# Altium schematic sheet Sheet1.SchDoc
size A3
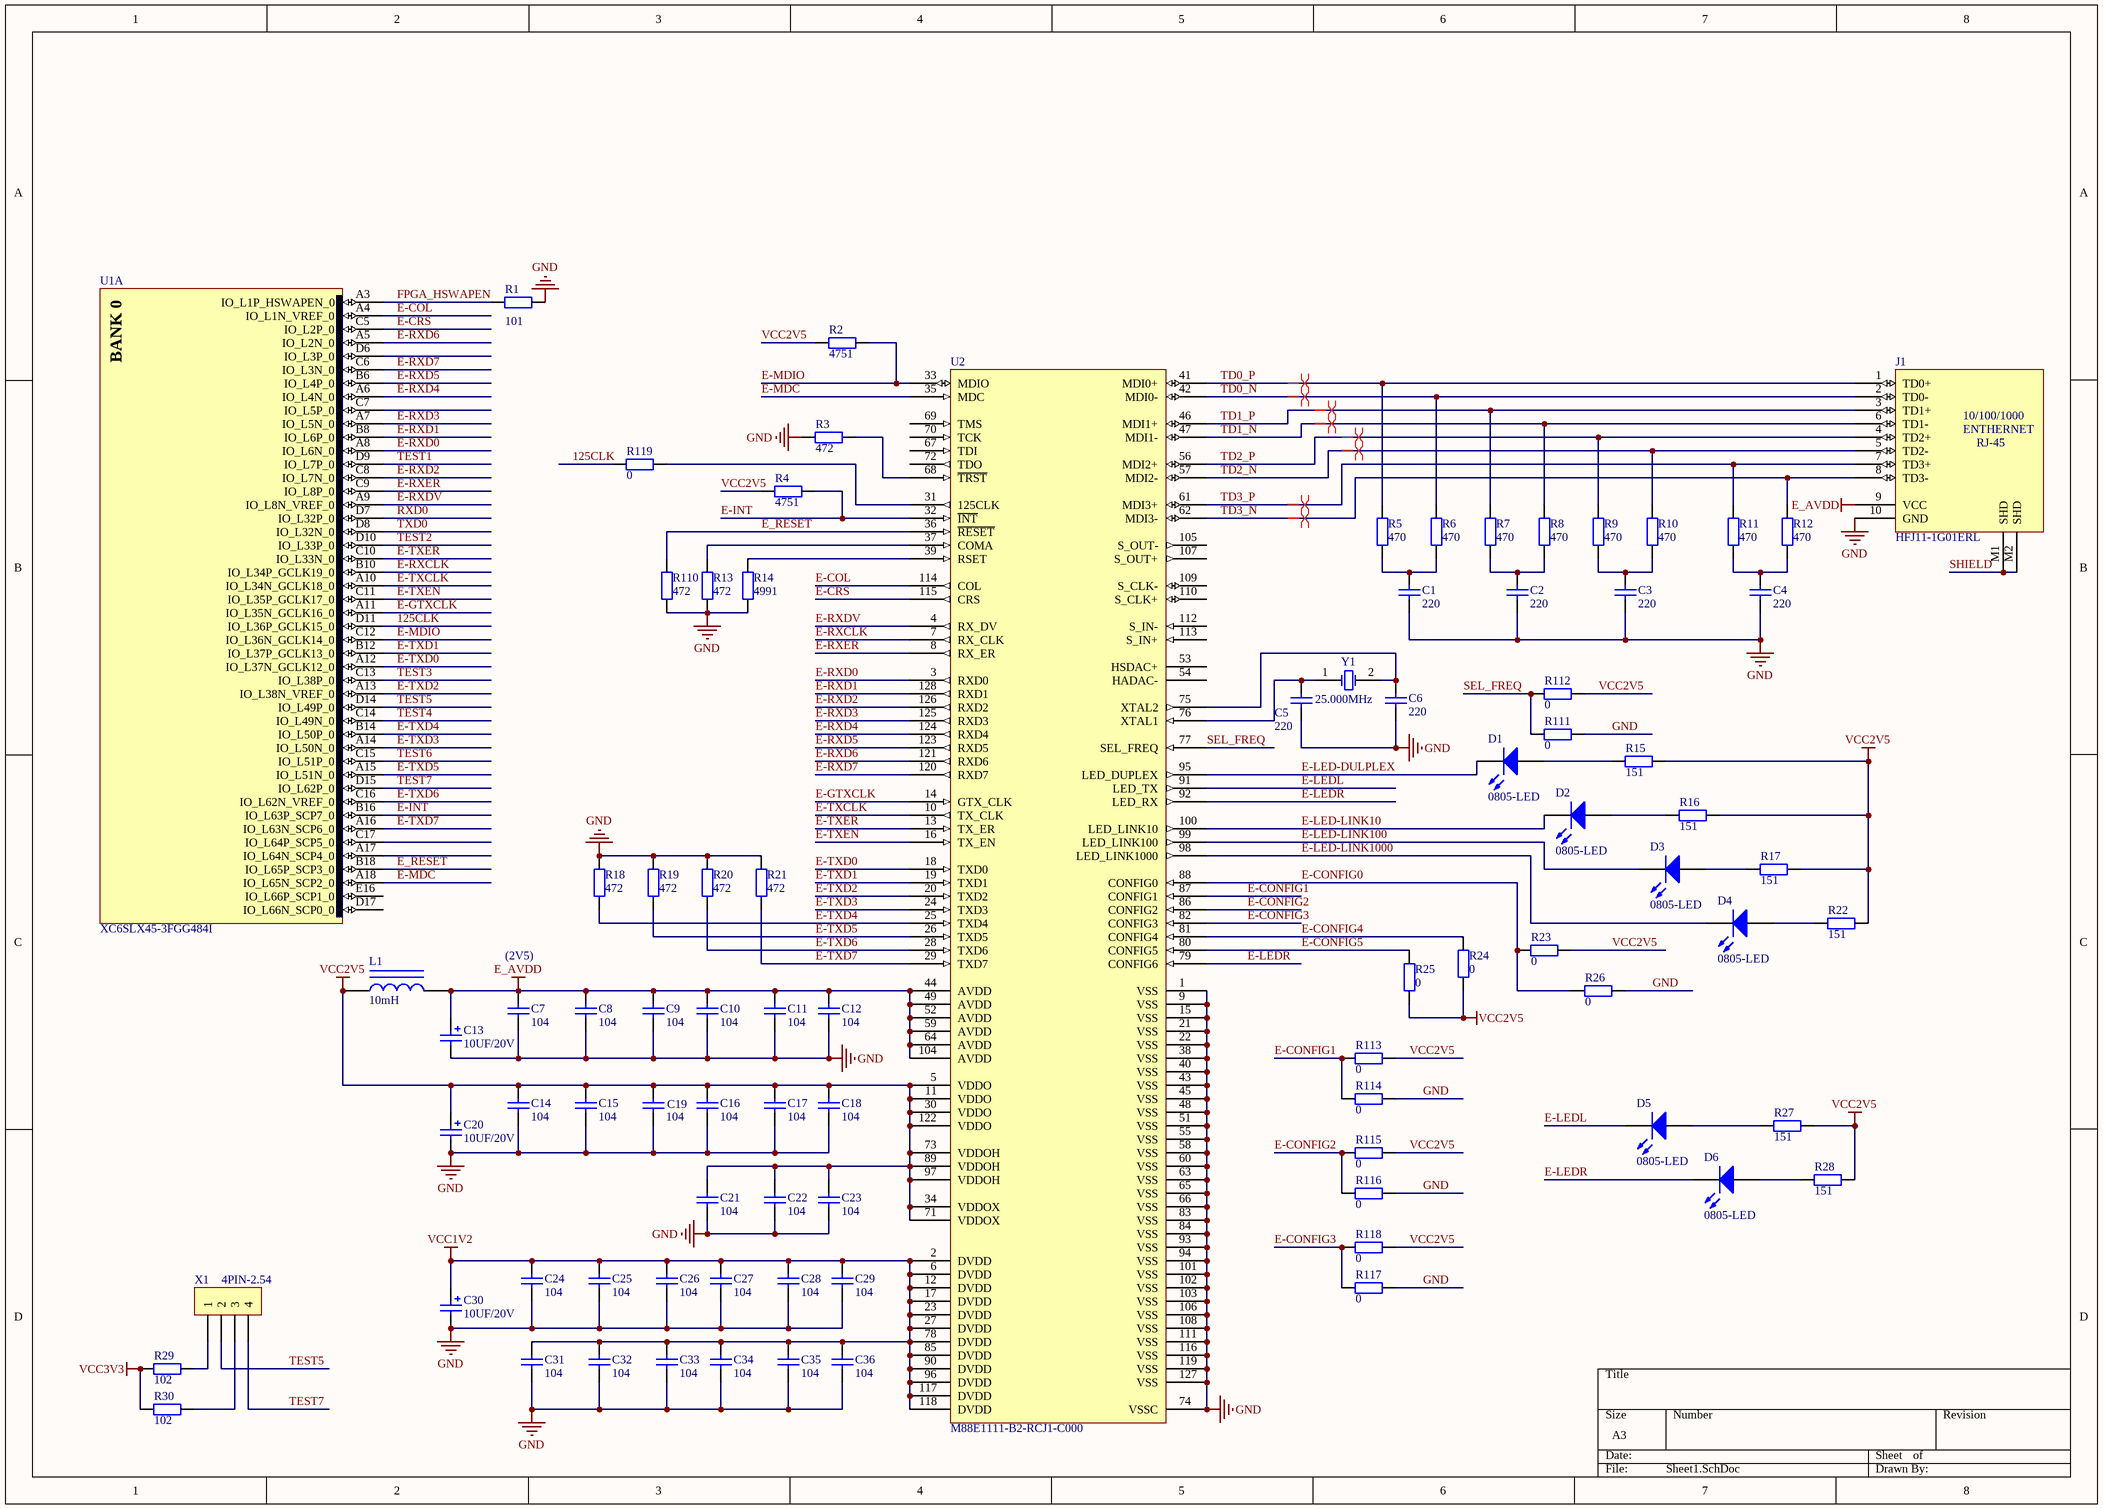
[diagram p0: Sheet1.SchDoc]

## Parts
C1  220  [0402]
C2  220  [0402]
C3  220  [0402]
C4  220  [0402]
C5  220  [0402]
C6  220  [0402]
C7  104  [0402]
C8  104  [0402]
C9  104  [0402]
C10  104  [0402]
C11  104  [0402]
C12  104  [0402]
C13  10UF/20V  [CAP-B]
C14  104  [0402]
C15  104  [0402]
C16  104  [0402]
C17  104  [0402]
C18  104  [0402]
C19  104  [0402]
C20  10UF/20V  [CAP-B]
C21  104  [0402]
C22  104  [0402]
C23  104  [0402]
C24  104  [0402]
C25  104  [0402]
C26  104  [0402]
C27  104  [0402]
C28  104  [0402]
C29  104  [0402]
C30  10UF/20V  [CAP-B]
C31  104  [0402]
C32  104  [0402]
C33  104  [0402]
C34  104  [0402]
C35  104  [0402]
C36  104  [0402]
D1  0805-LED  [0805LED]
D2  0805-LED  [0805LED]
D3  0805-LED  [0805LED]
D4  0805-LED  [0805LED]
D5  0805-LED  [0805LED]
D6  0805-LED  [0805LED]
J1  HFJ11-1G01ERL  [HFJ11-1G01ERL]
L1  10mH  [1206A]
R1  101  [0603]
R2  4751  [0603]
R3  472  [0603]
R4  4751  [0603]
R5  470  [0603]
R6  470  [0603]
R7  470  [0603]
R8  470  [0603]
R9  470  [0603]
R10  470  [0603]
R11  470  [0603]
R12  470  [0603]
R13  472  [0603]
R14  4991  [0603]
R15  151  [0603]
R16  151  [0603]
R17  151  [0603]
R18  472  [0603]
R19  472  [0603]
R20  472  [0603]
R21  472  [0603]
R22  151  [0603]
R23  0  [0603]
R24  0  [0603]
R25  0  [0603]
R26  0  [0603]
R27  151  [0603]
R28  151  [0603]
R29  102  [0603]
R30  102  [0603]
R110  472  [0603]
R111  0  [0402]
R112  0  [0402]
R113  0  [0402]
R114  0  [0402]
R115  0  [0402]
R116  0  [0402]
R117  0  [0402]
R118  0  [0402]
R119  0  [0603]
U1  XC6SLX45-3FGG484I  [FGG484]  (part A of 8)
U2  M88E1111-B2-RCJ1-C000  [SQFP50P1720X2320-128L]
X1  4PIN-2.54  [SIP4X]
Y1  25.000MHz  [CRYSTAL_2]

## Nets
E_AVDD: C7.2 C8.2 C9.2 C10.2 C11.2 C12.2 C13.1 J1.9(VCC) L1.2 U2.44(AVDD) U2.49(AVDD) U2.52(AVDD) U2.59(AVDD) U2.64(AVDD) U2.104(AVDD)
GND: C1.1 C2.1 C3.1 C4.1 C5.1 C6.1 C7.1 C8.1 C9.1 C10.1 C11.1 C12.1 C13.2 C14.1 C15.1 C16.1 C17.1 C18.1 C19.1 C20.2 C21.1 C22.1 C23.1 C24.1 C25.1 C26.1 C27.1 C28.1 C29.1 C30.2 C31.1 C32.1 C33.1 C34.1 C35.1 C36.1 J1.10(GND) R1.1 R3.1 R13.1 R14.1 R18.2 R19.2 R20.2 R21.2 R26.1 R110.1 R111.1 R114.1 R116.1 R117.1 U2.1(VSS) U2.9(VSS) U2.15(VSS) U2.21(VSS) U2.22(VSS) U2.38(VSS) U2.40(VSS) U2.43(VSS) U2.45(VSS) U2.48(VSS) U2.51(VSS) U2.55(VSS) U2.58(VSS) U2.60(VSS) U2.63(VSS) U2.65(VSS) U2.66(VSS) U2.74(VSSC) U2.83(VSS) U2.84(VSS) U2.93(VSS) U2.94(VSS) U2.101(VSS) U2.102(VSS) U2.103(VSS) U2.106(VSS) U2.108(VSS) U2.111(VSS) U2.116(VSS) U2.119(VSS) U2.127(VSS)
VCC1V2: C24.2 C25.2 C26.2 C27.2 C28.2 C29.2 C30.1 C31.2 C32.2 C33.2 C34.2 C35.2 C36.2 U2.2(DVDD) U2.6(DVDD) U2.12(DVDD) U2.17(DVDD) U2.23(DVDD) U2.27(DVDD) U2.78(DVDD) U2.85(DVDD) U2.90(DVDD) U2.96(DVDD) U2.117(DVDD) U2.118(DVDD)
VCC2V5: C14.2 C15.2 C16.2 C17.2 C18.2 C19.2 C20.1 C21.2 C22.2 C23.2 L1.1 R2.1 R4.1 R15.1 R16.1 R17.1 R22.1 R23.1 R24.2 R25.2 R27.1 R28.1 R112.1 R113.1 R115.1 R118.1 U2.5(VDDO) U2.11(VDDO) U2.30(VDDO) U2.34(VDDOX) U2.71(VDDOX) U2.73(VDDOH) U2.89(VDDOH) U2.97(VDDOH) U2.122(VDDO)
VCC3V3: R29.1 R30.1
125CLK: R119.2 U1.D11(IO_L36P_GCLK15_0)
E-COL: U1.A4(IO_L1N_VREF_0) U2.114(COL)
E-CONFIG0: R23.2 R26.2 U2.88(CONFIG0)
E-CONFIG1: R113.2 R114.2 U2.87(CONFIG1)
E-CONFIG2: R115.2 R116.2 U2.86(CONFIG2)
E-CONFIG3: R117.2 R118.2 U2.82(CONFIG3)
E-CONFIG4: R24.1 U2.81(CONFIG4)
E-CONFIG5: R25.1 U2.80(CONFIG5)
E-CRS: U1.C5(IO_L2P_0) U2.115(CRS)
E-GTXCLK: U1.A11(IO_L35N_GCLK16_0) U2.14(GTX_CLK)
E-INT: R4.2 U1.B16(IO_L63P_SCP7_0) U2.32(~{INT})
E-LED-DULPLEX: D1.2(K) U2.95(LED_DUPLEX)
E-LED-LINK10: D2.2(K) U2.100(LED_LINK10)
E-LED-LINK100: D3.2(K) U2.99(LED_LINK100)
E-LED-LINK1000: D4.2(K) U2.98(LED_LINK1000)
E-LEDL: D5.2(K) U2.91(LED_TX)
E-LEDR: D6.2(K) U2.79(CONFIG6) U2.92(LED_RX)
E-MDC: U1.A18(IO_L65N_SCP2_0) U2.35(MDC)
E-MDIO: R2.2 U1.C12(IO_L36N_GCLK14_0) U2.33(MDIO)
E-RXCLK: U1.B10(IO_L34P_GCLK19_0) U2.7(RX_CLK)
E-RXD0: U1.A8(IO_L6N_0) U2.3(RXD0)
E-RXD1: U1.B8(IO_L6P_0) U2.128(RXD1)
E-RXD2: U1.C8(IO_L7N_0) U2.126(RXD2)
E-RXD3: U1.A7(IO_L5N_0) U2.125(RXD3)
E-RXD4: U1.A6(IO_L4N_0) U2.124(RXD4)
E-RXD5: U1.B6(IO_L4P_0) U2.123(RXD5)
E-RXD6: U1.A5(IO_L2N_0) U2.121(RXD6)
E-RXD7: U1.C6(IO_L3N_0) U2.120(RXD7)
E-RXDV: U1.A9(IO_L8N_VREF_0) U2.4(RX_DV)
E-RXER: U1.C9(IO_L8P_0) U2.8(RX_ER)
E-TXCLK: U1.A10(IO_L34N_GCLK18_0) U2.10(TX_CLK)
E-TXD0: U1.A12(IO_L37N_GCLK12_0) U2.18(TXD0)
E-TXD1: U1.B12(IO_L37P_GCLK13_0) U2.19(TXD1)
E-TXD2: U1.A13(IO_L38N_VREF_0) U2.20(TXD2)
E-TXD3: U1.A14(IO_L50N_0) U2.24(TXD3)
E-TXD4: R18.1 U1.B14(IO_L50P_0) U2.25(TXD4)
E-TXD5: R19.1 U1.A15(IO_L51N_0) U2.26(TXD5)
E-TXD6: R20.1 U1.C16(IO_L62N_VREF_0) U2.28(TXD6)
E-TXD7: R21.1 U1.A16(IO_L63N_SCP6_0) U2.29(TXD7)
E-TXEN: U1.C11(IO_L35P_GCLK17_0) U2.16(TX_EN)
E-TXER: U1.C10(IO_L33N_0) U2.13(TX_ER)
E_RESET: R110.2 U1.B18(IO_L65P_SCP3_0) U2.36(~{RESET})
FPGA_HSWAPEN: R1.2 U1.A3(IO_L1P_HSWAPEN_0)
RXD0: U1.D7(IO_L32P_0)
SEL_FREQ: R111.2 R112.2 U2.77(SEL_FREQ)
SHIELD: J1.M1(SHD) J1.M2(SHD)
TD0_N: J1.2(TD0-) R6.2 U2.42(MDI0-)
TD0_P: J1.1(TD0+) R5.2 U2.41(MDI0+)
TD1_N: J1.6(TD1-) R8.2 U2.47(MDI1-)
TD1_P: J1.3(TD1+) R7.2 U2.46(MDI1+)
TD2_N: J1.5(TD2-) R10.2 U2.57(MDI2-)
TD2_P: J1.4(TD2+) R9.2 U2.56(MDI2+)
TD3_N: J1.8(TD3-) R12.2 U2.62(MDI3-)
TD3_P: J1.7(TD3+) R11.2 U2.61(MDI3+)
TEST1: U1.D9(IO_L7P_0)
TEST2: U1.D10(IO_L33P_0)
TEST3: U1.C13(IO_L38P_0)
TEST4: U1.C14(IO_L49N_0)
TEST5: U1.D14(IO_L49P_0) X1.2
TEST6: U1.C15(IO_L51P_0)
TEST7: U1.D15(IO_L62P_0) X1.4
TXD0: U1.D8(IO_L32N_0)
NetC1_2: C1.2 R5.1 R6.1
NetC2_2: C2.2 R7.1 R8.1
NetC3_2: C3.2 R9.1 R10.1
NetC4_2: C4.2 R11.1 R12.1
NetC5_2: C5.2 U2.76(XTAL1) Y1.1(OSC1)
NetC6_2: C6.2 U2.75(XTAL2) Y1.2(OSC2)
NetD1_1: D1.1(A) R15.2
NetD2_1: D2.1(A) R16.2
NetD3_1: D3.1(A) R17.2
NetD4_1: D4.1(A) R22.2
NetD5_1: D5.1(A) R27.2
NetD6_1: D6.1(A) R28.2
NetR3_2: R3.2 U2.68(~{TRST})
NetR13_2: R13.2 U2.37(COMA)
NetR14_2: R14.2 U2.39(RSET)
NetR29_2: R29.2 X1.1
NetR30_2: R30.2 X1.3
NetR119_1: R119.1 U2.31(125CLK)

Not connected (* = marked no-connect by the designer): U1 A17(IO_L64N_SCP4_0) C7(IO_L5P_0) C17(IO_L64P_SCP5_0) D6(IO_L3P_0) D17(IO_L66N_SCP0_0) E16(IO_L66P_SCP1_0); U2 53(HSDAC+) 54(HADAC-) 67(TDI) 69(TMS) 70(TCK) 72(TDO) 105(S_OUT-) 107(S_OUT+) 109(S_CLK-) 110(S_CLK+) 112(S_IN-) 113(S_IN+)

## Layout directives
differential pair: TD0_N, TD0_P, TD1_N, TD1_P, TD2_N, TD2_P, TD3_N, TD3_P

## Notes on the sheet
- (near C7) (2V5)
- (in symbol ETHERNET-RJ45) 10/100/1000; ENTHERNET; RJ-45
- (in symbol XC6SLX45-3FGG484I, part A) BANK 0

## Library data of the parts
C1-C6 = Cap: Capacitor; Value: 22pF; Published: 8-Jun-2000; LatestRevisionDate: 17-Jul-2002; LatestRevisionNote: Re-released for DXP Platform.; PackageReference: RAD-0.3; Publisher: Altium Limited
C7-C12 C14-C19 C21-C29 C31-C36 = Cap: Capacitor; Value: 0.1uF; Published: 8-Jun-2000; LatestRevisionDate: 17-Jul-2002; LatestRevisionNote: Re-released for DXP Platform.; PackageReference: RAD-0.3; Publisher: Altium Limited
C13 C20 C30 = Cap Pol2: Polarized Capacitor (Axial); Value: 100pF; Published: 8-Jun-2000; LatestRevisionDate: 17-Jul-2002; LatestRevisionNote: Re-released for DXP Platform.; PackageReference: POLAR0.8; Publisher: Altium Limited
D1-D6 = LED0: Typical INFRARED GaAs LED; Published: 8-Jun-2000; LatestRevisionDate: 08-Jul-2005; LatestRevisionNote: Mech Layer 1 removed.; PackageReference: LED-0; Publisher: Altium Limited
J1 = ETHERNET-RJ45
L1 = Inductor Iron: Magnetic-Core Inductor; Published: 24-Mar-1999; LatestRevisionDate: 17-Jul-2002; LatestRevisionNote: Re-released for DXP Platform.; PackageReference: AXIAL-0.9; Publisher: Altium Limited; Value: 10mH
R1 = Res2: Resistor; Value: 100R; Published: 8-Jun-2000; LatestRevisionDate: 17-Jul-2002; LatestRevisionNote: Re-released for DXP Platform.; PackageReference: AXIAL-0.4; Publisher: Altium Limited
R2 R4 = Res2: Resistor; Value: 4.75K; Published: 8-Jun-2000; LatestRevisionDate: 17-Jul-2002; LatestRevisionNote: Re-released for DXP Platform.; PackageReference: AXIAL-0.4; Publisher: Altium Limited
R3 R13 R18-R21 R110 = Res2: Resistor; Value: 4K7; Published: 8-Jun-2000; LatestRevisionDate: 17-Jul-2002; LatestRevisionNote: Re-released for DXP Platform.; PackageReference: AXIAL-0.4; Publisher: Altium Limited
R5-R12 = Res2: Resistor; Value: 47R; Published: 8-Jun-2000; LatestRevisionDate: 17-Jul-2002; LatestRevisionNote: Re-released for DXP Platform.; PackageReference: AXIAL-0.4; Publisher: Altium Limited
R14 = Res2: Resistor; Value: 4.99K; Published: 8-Jun-2000; LatestRevisionDate: 17-Jul-2002; LatestRevisionNote: Re-released for DXP Platform.; PackageReference: AXIAL-0.4; Publisher: Altium Limited
R15-R17 R22 R27-R30 = Res2: Resistor; Value: 150R; Published: 8-Jun-2000; LatestRevisionDate: 17-Jul-2002; LatestRevisionNote: Re-released for DXP Platform.; PackageReference: AXIAL-0.4; Publisher: Altium Limited
R23-R26 R111-R119 = Res2: Resistor; Value: 0R; Published: 8-Jun-2000; LatestRevisionDate: 17-Jul-2002; LatestRevisionNote: Re-released for DXP Platform.; PackageReference: AXIAL-0.4; Publisher: Altium Limited
U1 = XC6SLX45-3FGG484I: Spartan-6 LX 1.2V FPGA, 316 User I/Os, 484-Ball Fine-Pitch BGA (1.0mm Pitch), Speed Grade 3, Industrial Grade, Pb-Free; FirstPublished: 17-Nov-2009; DatasheetVersion: ver1.3, Nov-2009; PackageVersion: ver1.1, Dec-2008; PackageReference: FGG484; Publisher: Altium Limited; PackageDescription: 484-Ball Fine Pitch Ball Grid Array 1.00 mm Pitch (FGG484) - Pb-Free; Code_JEDEC: MS-034-AAJ-1; Code_IPC: BGA100P22X22-484; ComponentLink1Description: Spartan-6 Datasheet; ComponentLink1URL: http://www.xilinx.com/support/documentation/data_sheets/ds160.pdf; ComponentLink2Description: Pinout Specification; ComponentLink2URL: http://www.xilinx.com/support/documentation/user_guides/ug385.pdf; ComponentLink3Description: FGG484 Package Drawing; ComponentLink3URL: http://www.xilinx.com/support/documentation/package_specs/fg484.pdf; ComponentLink4Description: Spartan-6 Documents; ComponentLink4URL: http://www.xilinx.com/support/documentation/spartan-6.htm; ComponentLink5Description: Xilinx.com Home; ComponentLink5URL: http://www.xilinx.com
U2 = Component_1
X1 = CON4: Connector
Y1 = XTAL: Crystal Oscillator; Published: 8-Jun-2000; LatestRevisionDate: 17-Jul-2002; LatestRevisionNote: Re-released for DXP Platform.; PackageReference: R38; Publisher: Altium Limited